# Altium schematic sheet QPL9058.SchDoc
size A4; Organization: Altium Limited; Address1: L3, 12a Rodborough Rd; Address2: Frenchs Forest; Address3: NSW; Address4: Australia 2086; DocumentNumber: 5; SheetNumber: 5; SheetTotal: 7
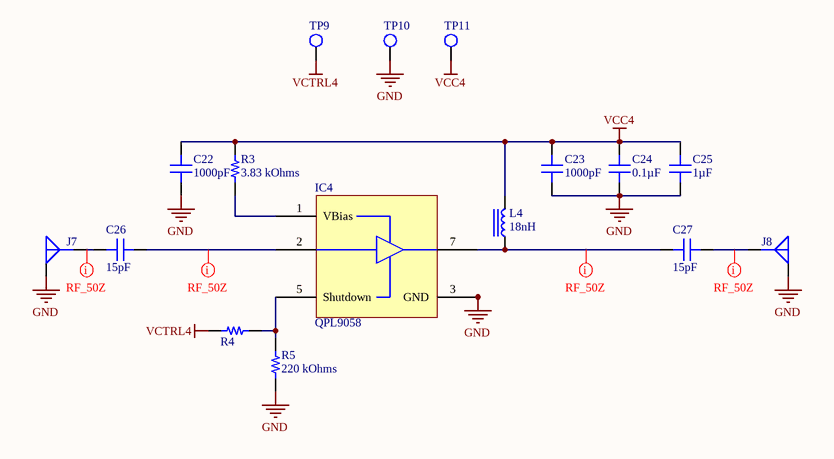
[diagram p0: QPL9058.SchDoc]

## Parts
C22  1000pF  [CAP 0402_1005]
C23  1000pF  [CAP 0402_1005]
C24  0.1µF  [CAP 0402_1005]
C25  1µF  [CAP 0402_1005]
C26  15pF  [CAP 0402_1005 RF]
C27  15pF  [CAP 0402_1005 RF]
IC4  QPL9058  [Qorvo LNA DFN-8 2X2]
J7  CON-SMA-EDGE-S  [CON-SMA-EDGE-S]  (value not drawn)
J8  CON-SMA-EDGE-S  [CON-SMA-EDGE-S]  (value not drawn)
L4  18nH  [0603CS]
R3  3.83 kOhms  [RES 0402_1005]
R4  (no value)  [RES 0402_1005]
R5  220 kOhms  [RES 0402_1005]
TP9  Test Point-THM  [KEYSTONE-THM-TestPoint]  (value not drawn)
TP10  Test Point-THM  [KEYSTONE-THM-TestPoint]  (value not drawn)
TP11  Test Point-THM  [KEYSTONE-THM-TestPoint]  (value not drawn)

## Nets
GND: C22.2 C23.1 C24.1 C25.1 IC4.3(GND) IC4.4(GND) IC4.6(GND) IC4.8(GND) IC4.9(GND) J7.2(G) J8.2(G) R5.1 TP10.1(TP)
VCC4: C22.1 C23.2 C24.2 C25.2 L4.2 R3.2 TP11.1(TP)
VCTRL4: R4.1 TP9.1(TP)
NetC26_1: C26.1 J7.1(S)
NetC26_2: C26.2 IC4.2(IN)
NetC27_1: C27.1 IC4.7(OUT) L4.1
NetC27_2: C27.2 J8.1(S)
NetIC4_1: IC4.1(VBias) R3.1
NetIC4_5: IC4.5(Shutdown) R4.2 R5.2

## Layout directives
net class RF_50Z: NetC26_1, NetC26_2, NetC27_1, NetC27_2

## Notes on the sheet
- Title
- Author:
- Murat Kucukyilmaz
- Number:
- Date:
- Sheet
- of

## Library data of the parts
C22 C23 = GCM155R71H102KA37D: CAP CER 1000PF 50V X7R 0402; Manufacturer: Murata Electronics; Tolerance: ±10%; Part Number: GCM155R71H102KA37D; Value: 1000pF; Applications: Automotive; Capacitance: 1000pF; ComponentLink1Description: Datasheet; ComponentLink1URL: https://psearch.en.murata.com/capacitor/product/GCM155R71H102KA37%23.pdf; ComponentLink2Description: DigiKey Link; ComponentLink2URL: http://digikey.com/product-detail/en/murata-electronics/GCM155R71H102KA37D/490-4761-1-ND/1641680; Device Package: 0402 (1005 Metric); LastUpdated: 2.09.2020 01:01:39; Lifecycle Status: Active; Minimum Order: 1; Mounting Type: Surface Mount, MLCC; Operating Temperature: -55°C ~ 125°C; Package / Case: 0402 (1005 Metric); Packaging: TapeAndReel; PartId: 12579; Part Status: Active; Price: 0.01; Ratings: AEC-Q200; Series: GCM; Size / Dimension: 0.039" L x 0.020" W (1.00mm x 0.50mm); Supplier 1: DigiKey; Supplier Part Number 1: 490-4761-1-ND; Temperature Coefficient: X7R; Thickness (Max): 0.022" (0.55mm); Voltage - Rated: 50V
C24 = EMK105B7104KV-F: CAP CER 0.1UF 16V X7R 0402; Manufacturer: Taiyo Yuden; Tolerance: ±10%; Part Number: EMK105B7104KV-F; Value: 0.1µF; Applications: General Purpose; Capacitance: 0.1µF; ComponentLink1Description: Datasheet; ComponentLink1URL: https://ds.yuden.co.jp/TYCOMPAS/ut/detail?pn=EMK105B7104KV-F  &u=M; ComponentLink2Description: DigiKey Link; ComponentLink2URL: http://digikey.com/product-detail/en/taiyo-yuden/EMK105B7104KV-F/587-1451-1-ND/1004082; Device Package: 0402 (1005 Metric); LastUpdated: 2.09.2020 01:02:15; Lifecycle Status: Active; Minimum Order: 1; Mounting Type: Surface Mount, MLCC; Operating Temperature: -55°C ~ 125°C; Package / Case: 0402 (1005 Metric); Packaging: CutTape; PartId: 6070; Part Status: Active; Price: 0.10; Series: M; Size / Dimension: 0.039" L x 0.020" W (1.00mm x 0.50mm); Supplier 1: DigiKey; Supplier Part Number 1: 587-1451-1-ND; Temperature Coefficient: X7R; Thickness (Max): 0.022" (0.55mm); Voltage - Rated: 16V
C25 = CL05A105KP5NNNC: CAP CER 1UF 10V X5R 0402; Manufacturer: Samsung Electro-Mechanics; Tolerance: ±10%; Part Number: CL05A105KP5NNNC; Value: 1µF; Applications: General Purpose; Capacitance: 1µF; ComponentLink1Description: Datasheet; ComponentLink1URL: http://www.samsungsem.com/kr/support/product-search/mlcc/CL05A105KP5NNNC.jsp; ComponentLink2Description: DigiKey Link; ComponentLink2URL: http://digikey.com/product-detail/en/samsung-electro-mechanics/CL05A105KP5NNNC/1276-1076-1-ND/3889162; Device Package: 0402 (1005 Metric); LastUpdated: 2.09.2020 01:02:21; Lifecycle Status: Active; Minimum Order: 1; Mounting Type: Surface Mount, MLCC; Operating Temperature: -55°C ~ 85°C; Package / Case: 0402 (1005 Metric); Packaging: TapeAndReel; PartId: 3103; Part Status: Active; Price: 0.01; Series: CL; Size / Dimension: 0.039" L x 0.020" W (1.00mm x 0.50mm); Supplier 1: DigiKey; Supplier Part Number 1: 1276-1076-1-ND; Temperature Coefficient: X5R; Thickness (Max): 0.022" (0.55mm); Voltage - Rated: 10V
C26 C27 = GJM1555C1H150JB01D: CAP CER 15PF 50V C0G/NP0 0402; Manufacturer: Murata Electronics; Temperature Coefficient: C0G, NP0; Tolerance: ±5%; Part Number: GJM1555C1H150JB01D; Applications: RF, Microwave, High Frequency; Capacitance: 15pF; ComponentLink1Description: Datasheet; ComponentLink1URL: https://search.murata.co.jp/Ceramy/image/img/A01X/G101/ENG/GJM1555C1H150JB01-01.pdf; ComponentLink2Description: DigiKey Link; ComponentLink2URL: http://digikey.com/product-detail/en/murata-electronics/GJM1555C1H150JB01D/490-3117-1-ND/702383; Device Package: 0402 (1005 Metric); Features: High Q, Low Loss; LastUpdated: 2.09.2020 01:17:07; Lifecycle Status: Active; Minimum Order: 1; Mounting Type: Surface Mount, MLCC; Operating Temperature: -55°C ~ 125°C; Package / Case: 0402 (1005 Metric); Packaging: TapeAndReel; PartId: 692; Part Status: Active; Price: 0.04; Series: GJM; Size / Dimension: 0.039" L x 0.020" W (1.00mm x 0.50mm); Supplier 1: DigiKey; Supplier Part Number 1: 490-3117-1-ND; Thickness (Max): 0.022" (0.55mm); Value: 15pF; Voltage - Rated: 50V
IC4 = QPL9058: 0.5 – 6.0 GHz Ultra Low-Noise LNA; Part Number: QPL9058; Supplier 1: RFMW; Supplier Part Number 1: QPL9058
J7 J8 = CON-SMA-EDGE-S: CONN SMA JACK STR EDGE MNT; Part Number: CON-SMA-EDGE-S; Supplier 1: Digi-Key; Supplier 2: Mouser; Supplier Part Number 1: CON-SMA-EDGE-S-ND; Supplier Part Number 2: 223-CON-SMA-EDGE-S
L4 = 0603CS-18NXJLW: Fixed Inductors 1608 18nH Unshld 5% 700mA 170mOhms AECQ2; Value: 18nH; Supplier 1: Mouser; Supplier Part Number 1: 994-0603CS-18NXJLW
R3 = RC0402FR-073K83L: RES SMD 3.83K OHM 1% 1/16W 0402; Manufacturer: Yageo; Power (Watts): 0.063W, 1/16W; Temperature Coefficient: ±100ppm/°C; Part Number: RC0402FR-073K83L; Value: 3.83 kOhms; ComponentLink1Description: Datasheet; ComponentLink1URL: https://www.yageo.com/upload/media/product/productsearch/datasheet/rchip/PYu-RC_Group_51_RoHS_L_10.pdf; ComponentLink2Description: DigiKey Link; ComponentLink2URL: http://digikey.com/product-detail/en/yageo/RC0402FR-073K83L/311-3.83KLRCT-ND/2827952; Composition: Thick Film; Device Package: 0402 (1005 Metric); Features: Moisture Resistant; Height - Seated (Max): 0.016" (0.40mm); LastUpdated: 2.09.2020 01:07:27; Lifecycle Status: Active; Minimum Order: 1; Number of Terminations: 2; Operating Temperature: -55°C ~ 155°C; Package / Case: 0402 (1005 Metric); Packaging: CutTape; PartId: 20859; Part Status: Active; Price: 0.10; Resistance: 3.83 kOhms; Series: RC; Size / Dimension: 0.039" L x 0.020" W (1.00mm x 0.50mm); Supplier 1: DigiKey; Supplier Part Number 1: 311-3.83KLRCT-ND; Supplier Device Package: 0402; Tolerance: ±1%
R4 = RC0402JR-070RP: RES SMD 0 OHM JUMPER 1/16W 0402; Manufacturer: Yageo; Power (Watts): 0.063W, 1/16W; Part Number: RC0402JR-070RP; ComponentLink1Description: Datasheet; ComponentLink1URL: http://www.yageo.com/NewPortal/yageodocoutput?fileName=/pdf/R-Chip/PYu-RC_51_RoHS_P_0.pdf; ComponentLink2Description: DigiKey Link; ComponentLink2URL: http://digikey.com/product-detail/en/yageo/RC0402JR-070RP/YAG1279CT-ND/4935394; Composition: Thick Film; Device Package: 0402 (1005 Metric); Features: Moisture Resistant; Height - Seated (Max): 0.016" (0.40mm); LastUpdated: 2.09.2020 01:07:33; Lifecycle Status: Active; Minimum Order: 1; Number of Terminations: 2; Operating Temperature: -55°C ~ 155°C; Package / Case: 0402 (1005 Metric); Packaging: CutTape; PartId: 18920; Part Status: Active; Price: 0.10; Series: RC-P Lead Free; Size / Dimension: 0.039" L x 0.020" W (1.00mm x 0.50mm); Supplier 1: DigiKey; Supplier Part Number 1: YAG1279CT-ND; Supplier Device Package: 0402; Tolerance: Jumper
R5 = RC0402FR-07220KL: RES SMD 220K OHM 1% 1/16W 0402; Manufacturer: Yageo; Power (Watts): 0.063W, 1/16W; Temperature Coefficient: ±100ppm/°C; Part Number: RC0402FR-07220KL; Value: 220 kOhms; ComponentLink1Description: Datasheet; ComponentLink1URL: https://www.yageo.com/upload/media/product/productsearch/datasheet/rchip/PYu-RC_Group_51_RoHS_L_10.pdf; ComponentLink2Description: DigiKey Link; ComponentLink2URL: http://digikey.com/product-detail/en/yageo/RC0402FR-07220KL/311-220KLRCT-ND/729511; Composition: Thick Film; Device Package: 0402 (1005 Metric); Features: Moisture Resistant; Height - Seated (Max): 0.016" (0.40mm); LastUpdated: 2.09.2020 01:08:10; Lifecycle Status: Active; Minimum Order: 1; Number of Terminations: 2; Operating Temperature: -55°C ~ 155°C; Package / Case: 0402 (1005 Metric); Packaging: CutTape; PartId: 2589; Part Status: Active; Price: 0.10; Resistance: 220 kOhms; Series: RC; Size / Dimension: 0.039" L x 0.020" W (1.00mm x 0.50mm); Supplier 1: DigiKey; Supplier Part Number 1: 311-220KLRCT-ND; Supplier Device Package: 0402; Tolerance: ±1%
TP9-TP11 = Test Point-THM: THRU HOLE MOUNT TEST POINTS; Supplier 1: Digi-Key; Supplier 2: Mouser; Supplier Part Number 1: 36-5012-ND; Supplier Part Number 2: 534-5012